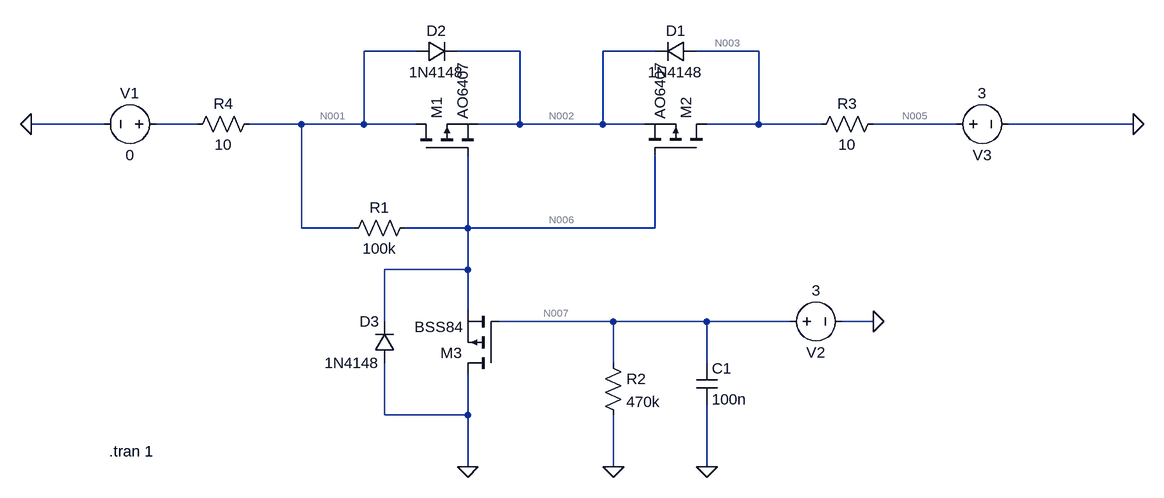
[diagram p0: schematic Autoswitch - DCDC.asc]
Autoswitch - DCDC.asc, the LTspice schematic file:
Version 4
SHEET 1 1476 1572
WIRE -112 912 -192 912
WIRE 48 912 -48 912
WIRE 256 912 176 912
WIRE 416 912 320 912
WIRE -592 1024 -704 1024
WIRE -448 1024 -512 1024
WIRE -288 1024 -368 1024
WIRE -192 1024 -192 912
WIRE -192 1024 -288 1024
WIRE -112 1024 -192 1024
WIRE 48 1024 48 912
WIRE 48 1024 -16 1024
WIRE 176 1024 176 912
WIRE 176 1024 48 1024
WIRE 240 1024 176 1024
WIRE 416 1024 416 912
WIRE 416 1024 336 1024
WIRE 512 1024 416 1024
WIRE 720 1024 592 1024
WIRE 992 1024 800 1024
WIRE -288 1184 -288 1024
WIRE -208 1184 -288 1184
WIRE -32 1184 -32 1072
WIRE -32 1184 -128 1184
WIRE 256 1184 256 1072
WIRE 256 1184 -32 1184
WIRE -32 1248 -32 1184
WIRE -32 1248 -160 1248
WIRE -32 1312 -32 1248
WIRE -160 1328 -160 1248
WIRE 192 1328 16 1328
WIRE 336 1328 192 1328
WIRE 464 1328 336 1328
WIRE 592 1328 544 1328
WIRE 192 1392 192 1328
WIRE 336 1392 336 1328
WIRE -160 1472 -160 1392
WIRE -32 1472 -32 1408
WIRE -32 1472 -160 1472
WIRE -32 1552 -32 1472
WIRE 192 1552 192 1472
WIRE 336 1552 336 1456
FLAG -704 1024 0
FLAG -32 1552 0
FLAG 192 1552 0
FLAG 336 1552 0
FLAG 592 1328 0
FLAG 992 1024 0
SYMBOL pmos -112 1072 R270
SYMATTR InstName M1
SYMATTR Value AO6407
SYMBOL pmos 336 1072 M270
SYMATTR InstName M2
SYMATTR Value AO6407
SYMBOL diode 320 896 R90
WINDOW 0 0 32 VBottom 2
WINDOW 3 32 32 VTop 2
SYMATTR InstName D1
SYMATTR Value 1N4148
SYMBOL diode -112 928 R270
WINDOW 0 32 32 VTop 2
WINDOW 3 0 32 VBottom 2
SYMATTR InstName D2
SYMATTR Value 1N4148
SYMBOL voltage -496 1024 R90
WINDOW 0 -32 56 VBottom 2
WINDOW 3 32 56 VTop 2
WINDOW 123 0 0 Left 0
WINDOW 39 0 0 Left 0
SYMATTR InstName V1
SYMATTR Value 0
SYMBOL res -112 1168 R90
WINDOW 0 0 56 VBottom 2
WINDOW 3 32 56 VTop 2
SYMATTR InstName R1
SYMATTR Value 100k
SYMBOL pmos 16 1408 R180
SYMATTR InstName M3
SYMATTR Value BSS84
SYMBOL res 176 1376 R0
SYMATTR InstName R2
SYMATTR Value 470k
SYMBOL cap 320 1392 R0
SYMATTR InstName C1
SYMATTR Value 100n
SYMBOL voltage 448 1328 R270
WINDOW 0 -32 56 VBottom 2
WINDOW 3 32 56 VTop 2
WINDOW 123 0 0 Left 0
WINDOW 39 0 0 Left 0
SYMATTR InstName V2
SYMATTR Value 3
SYMBOL res 496 1040 R270
WINDOW 0 32 56 VTop 2
WINDOW 3 0 56 VBottom 2
SYMATTR InstName R3
SYMATTR Value 10
SYMBOL diode -144 1392 R180
WINDOW 0 24 64 Left 2
WINDOW 3 24 0 Left 2
SYMATTR InstName D3
SYMATTR Value 1N4148
SYMBOL voltage 704 1024 R270
WINDOW 0 -32 56 VBottom 2
WINDOW 3 32 56 VTop 2
WINDOW 123 0 0 Left 0
WINDOW 39 0 0 Left 0
SYMATTR InstName V3
SYMATTR Value 3
SYMBOL res -464 1040 R270
WINDOW 0 32 56 VTop 2
WINDOW 3 0 56 VBottom 2
SYMATTR InstName R4
SYMATTR Value 10
TEXT -584 1528 Left 2 !.tran 1

The netlist it stands for:
* Autoswitch - DCDC.asc
M1 N001 N006 N002 N002 AO6407
M2 N003 N006 N002 N002 AO6407
D1 N003 N002 1N4148
D2 N001 N002 1N4148
V1 N004 0 0
R1 N006 N001 100k
M3 0 N007 N006 N006 BSS84
R2 N007 0 470k
C1 N007 0 100n
V2 N007 0 3
R3 N003 N005 10
D3 0 N006 1N4148
V3 N005 0 3
R4 N004 N001 10
.model D D
.lib standard.dio
.model NMOS NMOS
.model PMOS PMOS
.lib standard.mos
.tran 1
.backanno
.end

* Results of the author's LTspice run, read from the files saved beside the schematic
* Operating Point, zero values left out:
*   V(n001) = 1.067 V
*   V(n006) = 1.067 V
*   V(n002) = 1.892 V
*   V(n003) = 1.933 V
*   V(n007) = 3 V
*   V(n005) = 3 V
*   Id(M3) = -3.067 pA
*   Is(M3) = 3.067 pA
*   Id(M2) = 106.7 mA
*   Is(M2) = -106.7 mA
*   Id(M1) = -106.7 mA
*   Is(M1) = 106.7 mA
*   I(D3) = -2.521 nA
*   I(D2) = -2.521 nA
*   I(D1) = 3.69 nA
*   I(R4) = -106.7 mA
*   I(R3) = -106.7 mA
*   I(R2) = 6.383 µA
*   I(R1) = -2.525 nA
*   I(V3) = -106.7 mA
*   I(V2) = -6.383 µA
*   I(V1) = 106.7 mA